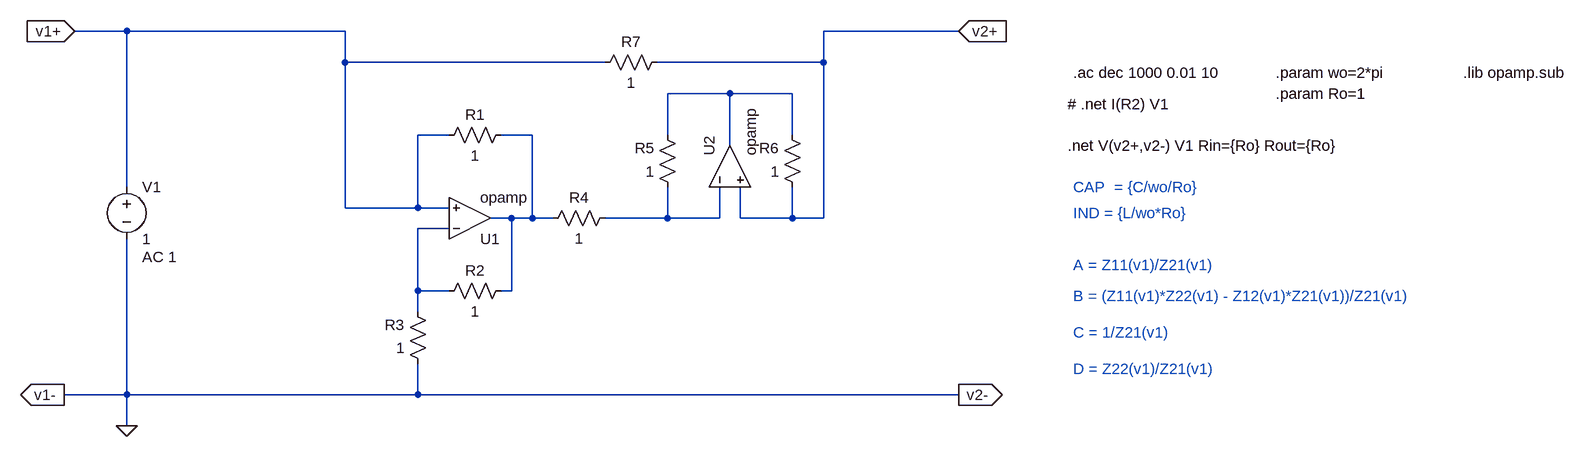
[diagram p0: schematic 3.asc]
3.asc, the LTspice schematic file:
Version 4.1
SHEET 1 1564 680
WIRE -1200 -48 -1280 -48
WIRE -864 -48 -1200 -48
WIRE 80 -48 -128 -48
WIRE -864 0 -864 -48
WIRE -464 0 -864 0
WIRE -128 0 -128 -48
WIRE -128 0 -384 0
WIRE -272 48 -368 48
WIRE -176 48 -272 48
WIRE -704 112 -752 112
WIRE -576 112 -624 112
WIRE -368 112 -368 48
WIRE -176 112 -176 48
WIRE -272 128 -272 48
WIRE -1200 192 -1200 -48
WIRE -864 224 -864 0
WIRE -752 224 -752 112
WIRE -752 224 -864 224
WIRE -704 224 -752 224
WIRE -608 240 -640 240
WIRE -576 240 -576 112
WIRE -576 240 -608 240
WIRE -544 240 -576 240
WIRE -368 240 -368 192
WIRE -368 240 -464 240
WIRE -288 240 -288 192
WIRE -288 240 -368 240
WIRE -256 240 -256 192
WIRE -176 240 -176 192
WIRE -176 240 -256 240
WIRE -128 240 -128 0
WIRE -128 240 -176 240
WIRE -704 256 -752 256
WIRE -752 352 -752 256
WIRE -704 352 -752 352
WIRE -608 352 -608 240
WIRE -608 352 -624 352
WIRE -752 384 -752 352
WIRE -1200 512 -1200 272
WIRE -1200 512 -1296 512
WIRE -752 512 -752 464
WIRE -752 512 -1200 512
WIRE 80 512 -752 512
WIRE -1200 560 -1200 512
FLAG -1280 -48 v1+
IOPIN -1280 -48 In
FLAG -1296 512 v1-
IOPIN -1296 512 Out
FLAG 80 -48 v2+
IOPIN 80 -48 In
FLAG 80 512 v2-
IOPIN 80 512 Out
FLAG -1200 560 0
SYMBOL voltage -1200 176 R0
WINDOW 123 24 124 Left 2
WINDOW 39 0 0 Left 0
SYMATTR Value2 AC 1
SYMATTR InstName V1
SYMATTR Value 1
SYMBOL res -608 96 R90
WINDOW 0 0 56 VBottom 2
WINDOW 3 32 56 VTop 2
SYMATTR InstName R1
SYMATTR Value 1
SYMBOL res -608 336 R90
WINDOW 0 0 56 VBottom 2
WINDOW 3 32 56 VTop 2
SYMATTR InstName R2
SYMATTR Value 1
SYMBOL res -736 480 R180
WINDOW 0 36 76 Left 2
WINDOW 3 36 40 Left 2
SYMATTR InstName R3
SYMATTR Value 1
SYMBOL res -448 224 R90
WINDOW 0 0 56 VBottom 2
WINDOW 3 32 56 VTop 2
SYMATTR InstName R4
SYMATTR Value 1
SYMBOL res -352 208 R180
WINDOW 0 36 76 Left 2
WINDOW 3 36 40 Left 2
SYMATTR InstName R5
SYMATTR Value 1
SYMBOL res -160 208 R180
WINDOW 0 36 76 Left 2
WINDOW 3 36 40 Left 2
SYMATTR InstName R6
SYMATTR Value 1
SYMBOL res -368 -16 R90
WINDOW 0 0 56 VBottom 2
WINDOW 3 32 56 VTop 2
SYMATTR InstName R7
SYMATTR Value 1
SYMBOL OpAmps\\opamp -672 304 M180
SYMATTR InstName U1
SYMBOL OpAmps\\opamp -336 160 R270
SYMATTR InstName U2
TEXT 256 16 Left 2 !.ac dec 1000 0.01 10
TEXT 248 64 Left 2 !# .net I(R2) V1
TEXT 248 128 Left 2 !.net V(v2+,v2-) V1 Rin={Ro} Rout={Ro}
TEXT 568 16 Left 2 !.param wo=2*pi
TEXT 568 48 Left 2 !.param Ro=1
TEXT 256 312 Left 2 ;A = Z11(v1)/Z21(v1)
TEXT 256 360 Left 2 ;B = (Z11(v1)*Z22(v1) - Z12(v1)*Z21(v1))/Z21(v1)
TEXT 256 416 Left 2 ;C = 1/Z21(v1)
TEXT 256 472 Left 2 ;D = Z22(v1)/Z21(v1)
TEXT 256 192 Left 2 ;CAP  = {C/wo/Ro}
TEXT 256 232 Left 2 ;IND = {L/wo*Ro}
TEXT 856 16 Left 2 !.lib opamp.sub

The netlist it stands for:
* 3.asc
V1 v1+ 0 1 AC 1
R1 N002 v1+ 1
R2 N002 N004 1
R3 0 N004 1
R4 N003 N002 1
R5 N003 N001 1
R6 v2+ N001 1
R7 v2+ v1+ 1
X§U1 N004 v1+ N002 opamp Aol=100K GBW=10Meg  ; pins invin noninvin out
X§U2 N003 v2+ N001 opamp Aol=100K GBW=10Meg  ; pins invin noninvin out
.ac dec 1000 0.01 10
# .net I(R2) V1
.net V(v2+,v2-) V1 Rin={Ro} Rout={Ro}
.param wo=2*pi
.param Ro=1
* A = Z11(v1)/Z21(v1)
* B = (Z11(v1)*Z22(v1) - Z12(v1)*Z21(v1))/Z21(v1)
* C = 1/Z21(v1)
* D = Z22(v1)/Z21(v1)
* CAP  = {C/wo/Ro}
* IND = {L/wo*Ro}
.lib opamp.sub
.backanno
.end